# EAGLE schematic Esquema (EAGLE 6.0)
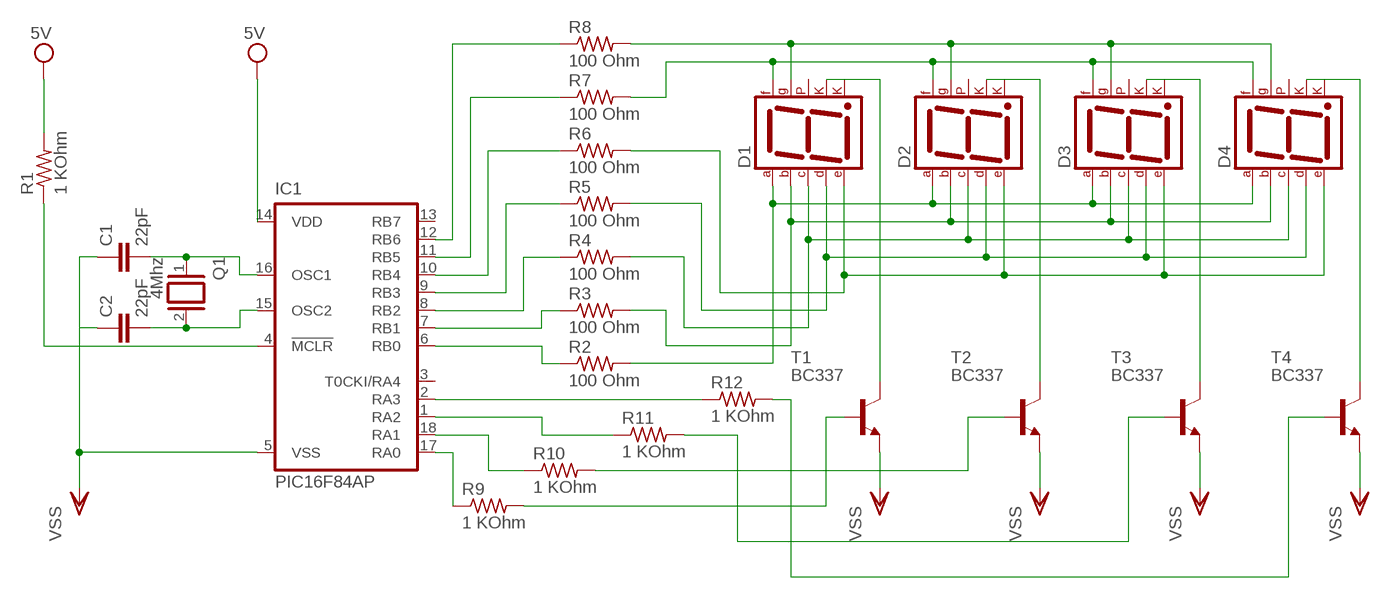
[diagram p0: schematic, sheet 1]

## Parts
C1  22pF  C2.5/4  [C2.5-4]
C2  22pF  C2.5/4  [C2.5-4]
D1  7SEG-CK  [7SEG-13]
D2  7SEG-CK  [7SEG-13]
D3  7SEG-CK  [7SEG-13]
D4  7SEG-CK  [7SEG-13]
IC1  PIC16F84AP  [DIL18]
Q1  4Mhz  XTAL  [Q]
R1  1 KOhm  R-US_0204/5  [0204/5]
R2  100 Ohm  R-US_0204/5  [0204/5]
R3  100 Ohm  R-US_0204/5  [0204/5]
R4  100 Ohm  R-US_0204/5  [0204/5]
R5  100 Ohm  R-US_0204/5  [0204/5]
R6  100 Ohm  R-US_0204/5  [0204/5]
R7  100 Ohm  R-US_0204/5  [0204/5]
R8  100 Ohm  R-US_0204/5  [0204/5]
R9  1 KOhm  R-US_0204/5  [0204/5]
R10  1 KOhm  R-US_0204/5  [0204/5]
R11  1 KOhm  R-US_0204/5  [0204/5]
R12  1 KOhm  R-US_0204/5  [0204/5]
T1  BC337  [TO92]
T2  BC337  [TO92]
T3  BC337  [TO92]
T4  BC337  [TO92]

## Nets
N$1: IC1.6(RB0) R2.1
N$2: IC1.7(RB1) R3.1
N$3: IC1.8(RB2) R4.1
N$4: IC1.9(RB3) R5.1
N$5: IC1.10(RB4) R6.1
N$6: IC1.11(RB5) R7.1
N$7: IC1.12(RB6) R8.1
N$8: C1.2 IC1.16(OSC1) Q1.1
N$9: C2.2 IC1.15(OSC2) Q1.2
N$10: D1.7(A) D2.7(A) D3.7(A) D4.7(A) R2.2
N$11: IC1.4(!MCLR) R1.1
N$12: D1.6(B) D2.6(B) D3.6(B) D4.6(B) R3.2
N$13: D1.4(C) D2.4(C) D3.4(C) D4.4(C) R4.2
N$14: D1.2(D) D2.2(D) D3.2(D) D4.2(D) R5.2
N$15: D1.1(E) D2.1(E) D3.1(E) D4.1(E) R6.2
N$16: D1.9(F) D2.9(F) D3.9(F) D4.9(F) R7.2
N$17: D1.10(G) D2.10(G) D3.10(G) D4.10(G) R8.2
N$18: D1.3(CK1) D1.8(CK2) T1.3(C)
N$19: D2.3(CK1) D2.8(CK2) T2.3(C)
N$20: D3.3(CK1) D3.8(CK2) T3.3(C)
N$21: D4.3(CK1) D4.8(CK2) T4.3(C)
N$22: IC1.17(RA0) R9.1
N$23: R9.2 T1.2(B)
N$24: IC1.18(RA1) R10.1
N$25: R10.2 T2.2(B)
N$26: IC1.1(RA2) R11.1
N$27: R11.2 T3.2(B)
N$28: IC1.2(RA3) R12.1
N$29: R12.2 T4.2(B)
VDD: IC1.14(VDD) R1.2 ; supply symbol labelled 5V
VSS: C1.1 C2.1 IC1.5(VSS) T1.1(E) T2.1(E) T3.1(E) T4.1(E)
Unconnected: D1.5(DP) D2.5(DP) D3.5(DP) D4.5(DP) IC1.3(T0CKI/RA4) IC1.13(RB7)

## Library data of the parts
C1 C2 = capacitor-wima:C: CAPACITOR naming: grid - package width
D1-D4 = special:7SEG-CK: 7-segment DISPLAY single cathode, 13 mm
IC1 = microchip:PIC16F8*: MICROCONTROLLER 8-Bit PIC16F8X Family - CMOS Flash/EEPROM Pin Compatible : PIC16F83, PIC16CR83, PIC16F84A, PIC16CR84 see also PIC16C* <DEVICE:PIC16C*>; MF: MICROCHIP; MPN: PIC16F84A-04I/P; OC_FARNELL: 9760865; OC_NEWARK: 69K7635
Q1 = special:XTAL: CRYSTAL
R1-R12 = resistor:R-US_: RESISTOR, American symbol
T1-T4 = transistor:BC337: NPN TRANSISTOR